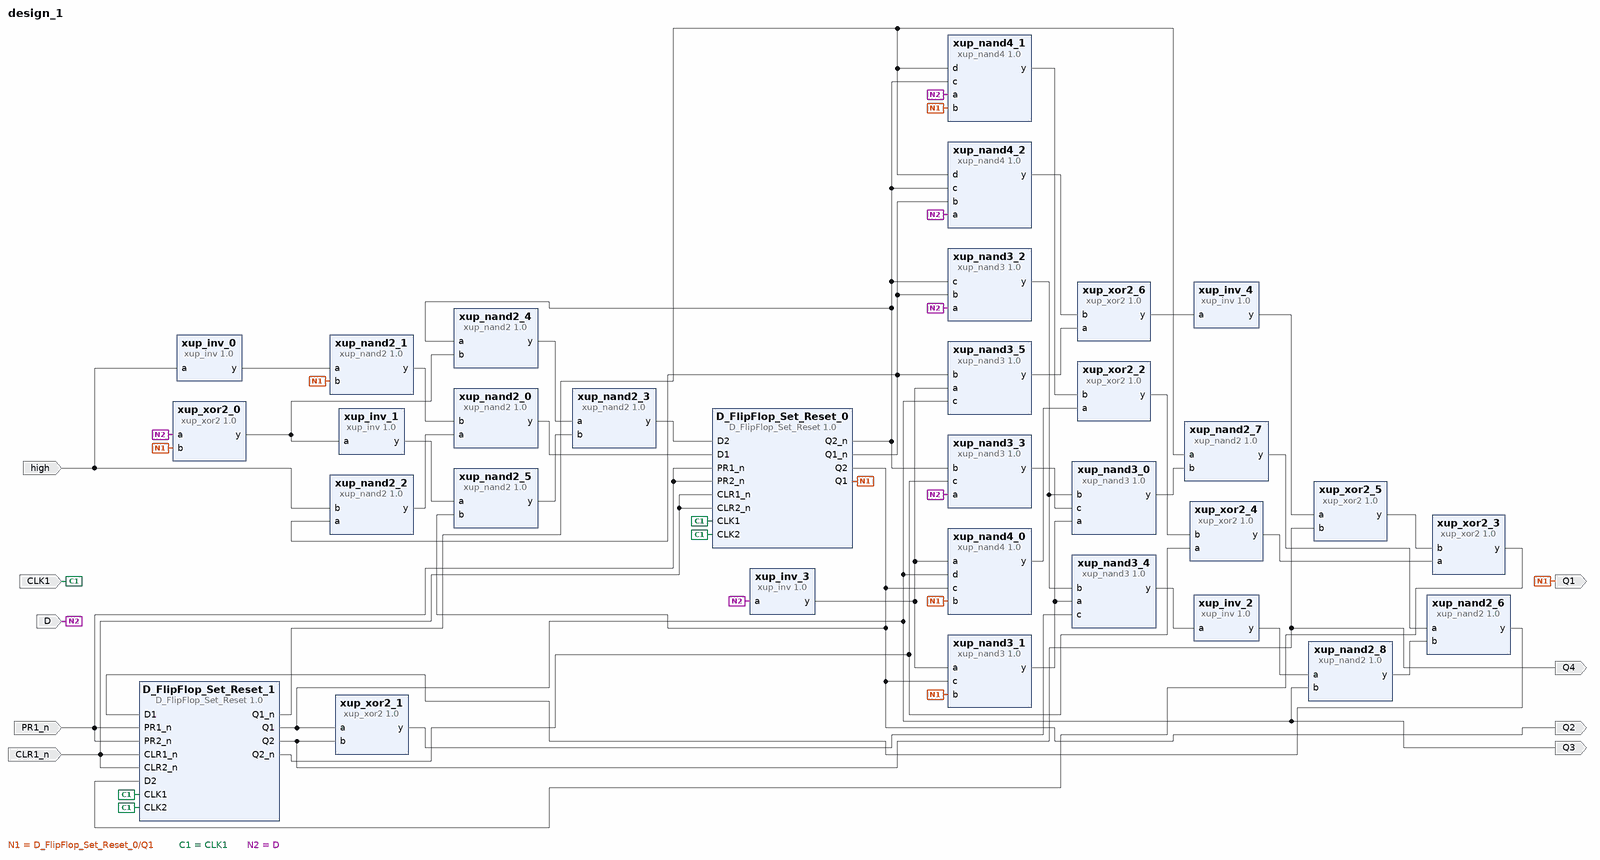
[diagram p0: block diagram of the top level]
# Vivado block design design_1, xc7a35tcpg236-1, Vivado 2016.4
create_bd_design design_1

create_bd_port -dir I high
create_bd_port -dir I CLK1
create_bd_port -dir I PR1_n
create_bd_port -dir I CLR1_n
create_bd_port -dir I D
create_bd_port -dir O Q1
create_bd_port -dir O Q2
create_bd_port -dir O Q3
create_bd_port -dir O Q4

create_bd_cell -type ip -vlnv xilinx.com:XUP:D_FlipFlop_Set_Reset:1.0 D_FlipFlop_Set_Reset_0
create_bd_cell -type ip -vlnv xilinx.com:XUP:D_FlipFlop_Set_Reset:1.0 D_FlipFlop_Set_Reset_1
create_bd_cell -type ip -vlnv xilinx.com:xup:xup_nand2:1.0 xup_nand2_0
create_bd_cell -type ip -vlnv xilinx.com:xup:xup_nand2:1.0 xup_nand2_1
create_bd_cell -type ip -vlnv xilinx.com:xup:xup_nand2:1.0 xup_nand2_2
create_bd_cell -type ip -vlnv xilinx.com:xup:xup_inv:1.0 xup_inv_0
create_bd_cell -type ip -vlnv xilinx.com:xup:xup_nand2:1.0 xup_nand2_3
create_bd_cell -type ip -vlnv xilinx.com:xup:xup_nand2:1.0 xup_nand2_4
create_bd_cell -type ip -vlnv xilinx.com:xup:xup_nand2:1.0 xup_nand2_5
create_bd_cell -type ip -vlnv xilinx.com:xup:xup_inv:1.0 xup_inv_1
create_bd_cell -type ip -vlnv xilinx.com:xup:xup_xor2:1.0 xup_xor2_0
create_bd_cell -type ip -vlnv xilinx.com:xup:xup_nand2:1.0 xup_nand2_6
create_bd_cell -type ip -vlnv xilinx.com:xup:xup_nand2:1.0 xup_nand2_7
create_bd_cell -type ip -vlnv xilinx.com:xup:xup_nand2:1.0 xup_nand2_8
create_bd_cell -type ip -vlnv xilinx.com:xup:xup_inv:1.0 xup_inv_2
create_bd_cell -type ip -vlnv xilinx.com:xup:xup_nand3:1.0 xup_nand3_0
create_bd_cell -type ip -vlnv xilinx.com:xup:xup_nand3:1.0 xup_nand3_1
create_bd_cell -type ip -vlnv xilinx.com:xup:xup_nand3:1.0 xup_nand3_2
create_bd_cell -type ip -vlnv xilinx.com:xup:xup_nand3:1.0 xup_nand3_3
create_bd_cell -type ip -vlnv xilinx.com:xup:xup_inv:1.0 xup_inv_3
create_bd_cell -type ip -vlnv xilinx.com:xup:xup_xor2:1.0 xup_xor2_1
create_bd_cell -type ip -vlnv xilinx.com:xup:xup_nand3:1.0 xup_nand3_4
create_bd_cell -type ip -vlnv xilinx.com:xup:xup_nand4:1.0 xup_nand4_0
create_bd_cell -type ip -vlnv xilinx.com:xup:xup_nand4:1.0 xup_nand4_1
create_bd_cell -type ip -vlnv xilinx.com:xup:xup_xor2:1.0 xup_xor2_2
create_bd_cell -type ip -vlnv xilinx.com:xup:xup_xor2:1.0 xup_xor2_3
create_bd_cell -type ip -vlnv xilinx.com:xup:xup_xor2:1.0 xup_xor2_4
create_bd_cell -type ip -vlnv xilinx.com:xup:xup_xor2:1.0 xup_xor2_5
create_bd_cell -type ip -vlnv xilinx.com:xup:xup_inv:1.0 xup_inv_4
create_bd_cell -type ip -vlnv xilinx.com:xup:xup_nand3:1.0 xup_nand3_5
create_bd_cell -type ip -vlnv xilinx.com:xup:xup_xor2:1.0 xup_xor2_6
create_bd_cell -type ip -vlnv xilinx.com:xup:xup_nand4:1.0 xup_nand4_2

# ---- connections ----

connect_bd_net [get_bd_pins xup_nand2_0/y] [get_bd_pins D_FlipFlop_Set_Reset_0/D1]
connect_bd_net [get_bd_pins xup_nand2_2/y] [get_bd_pins xup_nand2_0/a]
connect_bd_net [get_bd_pins xup_nand2_1/y] [get_bd_pins xup_nand2_0/b]
connect_bd_net [get_bd_pins D_FlipFlop_Set_Reset_0/Q1_n] \
  [get_bd_pins xup_nand2_2/a] [get_bd_pins xup_nand3_2/b] [get_bd_pins xup_nand3_5/b] [get_bd_pins xup_nand4_2/b]
connect_bd_net [get_bd_pins D_FlipFlop_Set_Reset_0/Q1] \
  [get_bd_pins xup_nand2_1/b] [get_bd_pins xup_xor2_0/b] [get_bd_pins xup_nand3_1/b] [get_bd_pins xup_nand4_0/b] \
  [get_bd_pins xup_nand4_1/b] [get_bd_ports Q1]
connect_bd_net [get_bd_pins xup_inv_0/y] [get_bd_pins xup_nand2_1/a]
connect_bd_net [get_bd_ports high] [get_bd_pins xup_nand2_2/b] [get_bd_pins xup_inv_0/a]
connect_bd_net [get_bd_ports PR1_n] \
  [get_bd_pins D_FlipFlop_Set_Reset_0/PR1_n] [get_bd_pins D_FlipFlop_Set_Reset_0/PR2_n] \
  [get_bd_pins D_FlipFlop_Set_Reset_1/PR1_n] [get_bd_pins D_FlipFlop_Set_Reset_1/PR2_n]
connect_bd_net [get_bd_ports CLR1_n] \
  [get_bd_pins D_FlipFlop_Set_Reset_0/CLR1_n] [get_bd_pins D_FlipFlop_Set_Reset_0/CLR2_n] \
  [get_bd_pins D_FlipFlop_Set_Reset_1/CLR1_n] [get_bd_pins D_FlipFlop_Set_Reset_1/CLR2_n]
connect_bd_net [get_bd_ports CLK1] \
  [get_bd_pins D_FlipFlop_Set_Reset_1/CLK1] [get_bd_pins D_FlipFlop_Set_Reset_0/CLK1] \
  [get_bd_pins D_FlipFlop_Set_Reset_0/CLK2] [get_bd_pins D_FlipFlop_Set_Reset_1/CLK2]
connect_bd_net [get_bd_pins xup_nand2_4/y] [get_bd_pins xup_nand2_3/a]
connect_bd_net [get_bd_pins xup_nand2_5/y] [get_bd_pins xup_nand2_3/b]
connect_bd_net [get_bd_pins xup_nand2_3/y] [get_bd_pins D_FlipFlop_Set_Reset_0/D2]
connect_bd_net [get_bd_pins D_FlipFlop_Set_Reset_0/Q2_n] \
  [get_bd_pins xup_nand2_4/a] [get_bd_pins xup_nand3_2/c] [get_bd_pins xup_nand3_3/b] [get_bd_pins xup_nand4_1/c] \
  [get_bd_pins xup_nand4_2/c]
connect_bd_net [get_bd_pins D_FlipFlop_Set_Reset_0/Q2] \
  [get_bd_pins xup_nand2_5/b] [get_bd_pins xup_nand3_1/c] [get_bd_pins xup_nand4_0/c] [get_bd_ports Q2]
connect_bd_net [get_bd_pins xup_inv_1/y] [get_bd_pins xup_nand2_5/a]
connect_bd_net [get_bd_pins xup_xor2_0/y] [get_bd_pins xup_nand2_4/b] [get_bd_pins xup_inv_1/a]
connect_bd_net [get_bd_ports D] \
  [get_bd_pins xup_xor2_0/a] [get_bd_pins xup_inv_3/a] [get_bd_pins xup_nand3_2/a] [get_bd_pins xup_nand3_3/a] \
  [get_bd_pins xup_nand4_1/a] [get_bd_pins xup_nand4_2/a]
connect_bd_net [get_bd_pins xup_nand2_7/y] [get_bd_pins xup_nand2_6/a]
connect_bd_net [get_bd_pins xup_nand2_8/y] [get_bd_pins xup_nand2_6/b]
connect_bd_net [get_bd_pins xup_nand2_6/y] [get_bd_pins D_FlipFlop_Set_Reset_1/D1]
connect_bd_net [get_bd_pins D_FlipFlop_Set_Reset_1/Q1_n] [get_bd_pins xup_nand2_7/a] [get_bd_pins xup_nand4_1/d] [get_bd_pins xup_nand4_2/d]
connect_bd_net [get_bd_pins D_FlipFlop_Set_Reset_1/Q1] \
  [get_bd_pins xup_nand2_8/b] [get_bd_pins xup_xor2_1/a] [get_bd_pins xup_nand4_0/d] [get_bd_pins xup_nand3_5/c] \
  [get_bd_ports Q3]
connect_bd_net [get_bd_pins xup_inv_2/y] [get_bd_pins xup_nand2_8/a]
connect_bd_net [get_bd_pins xup_nand3_1/y] [get_bd_pins xup_nand3_0/a] [get_bd_pins xup_nand3_4/a]
connect_bd_net [get_bd_pins xup_nand3_2/y] [get_bd_pins xup_nand3_0/b] [get_bd_pins xup_nand3_4/b]
connect_bd_net [get_bd_pins xup_nand3_3/y] [get_bd_pins xup_nand3_0/c]
connect_bd_net [get_bd_pins xup_nand3_0/y] [get_bd_pins xup_nand2_7/b]
connect_bd_net [get_bd_pins xup_inv_3/y] [get_bd_pins xup_nand3_1/a] [get_bd_pins xup_nand4_0/a] [get_bd_pins xup_nand3_5/a]
connect_bd_net [get_bd_pins D_FlipFlop_Set_Reset_1/Q2_n] [get_bd_pins xup_nand3_3/c] [get_bd_pins xup_xor2_4/a]
connect_bd_net [get_bd_pins xup_nand3_4/y] [get_bd_pins xup_inv_2/a]
connect_bd_net [get_bd_pins xup_xor2_1/y] [get_bd_pins xup_nand3_4/c]
connect_bd_net [get_bd_pins D_FlipFlop_Set_Reset_1/Q2] [get_bd_pins xup_xor2_1/b] [get_bd_pins xup_xor2_5/b] [get_bd_ports Q4]
connect_bd_net [get_bd_pins xup_nand4_0/y] [get_bd_pins xup_xor2_2/a]
connect_bd_net [get_bd_pins xup_nand4_1/y] [get_bd_pins xup_xor2_2/b]
connect_bd_net [get_bd_pins xup_xor2_3/y] [get_bd_pins D_FlipFlop_Set_Reset_1/D2]
connect_bd_net [get_bd_pins xup_xor2_4/y] [get_bd_pins xup_xor2_3/a]
connect_bd_net [get_bd_pins xup_xor2_5/y] [get_bd_pins xup_xor2_3/b]
connect_bd_net [get_bd_pins xup_inv_4/y] [get_bd_pins xup_xor2_5/a]
connect_bd_net [get_bd_pins xup_xor2_2/y] [get_bd_pins xup_xor2_4/b]
connect_bd_net [get_bd_pins xup_nand3_5/y] [get_bd_pins xup_xor2_6/a]
connect_bd_net [get_bd_pins xup_nand4_2/y] [get_bd_pins xup_xor2_6/b]
connect_bd_net [get_bd_pins xup_xor2_6/y] [get_bd_pins xup_inv_4/a]

validate_bd_design
save_bd_design
